# Altium project 800U R3N3.PrjPCB
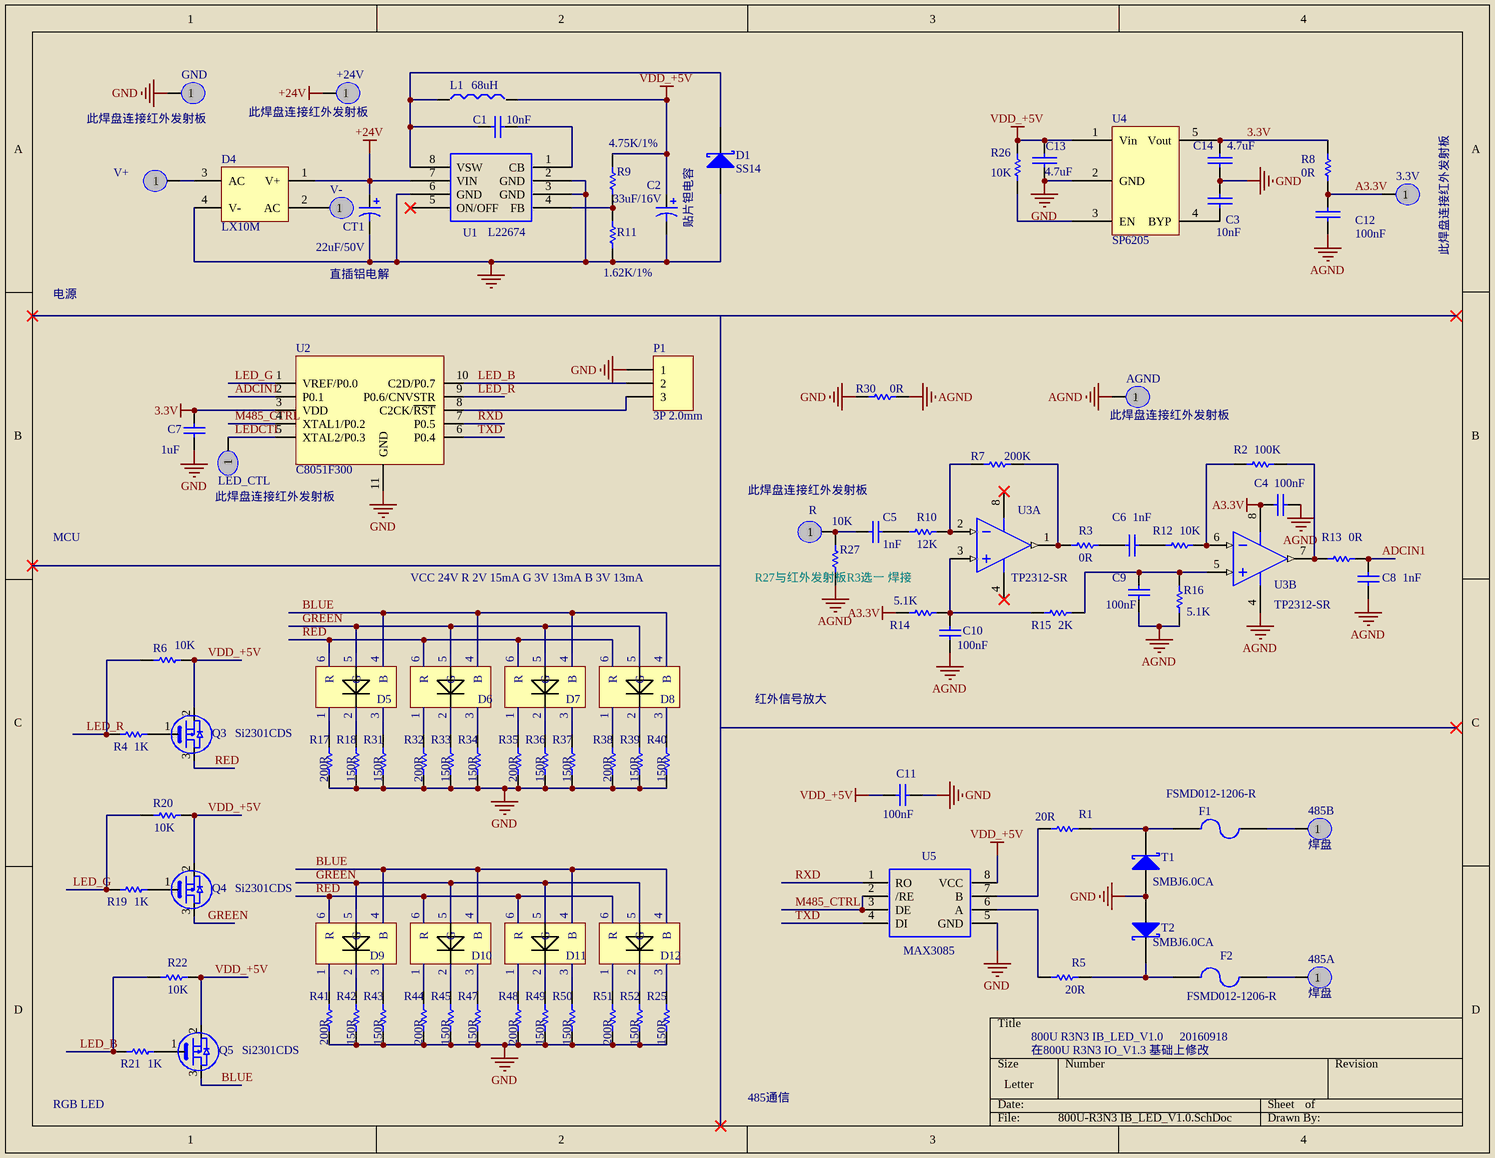
[diagram p0: 800U-R3N3 IB_LED_V1.0.SchDoc]
1 sheet, 96 parts. Net scope: global (net labels, ports and power ports of the same name join across sheets).
Board file: 800U R3N3 IB_LED_V1.0.PcbDoc

## Sheet 800U-R3N3 IB_LED_V1.0.SchDoc
size Letter

### Parts
3.3V  (no value)  [HOLE_SMD]
485A  焊盘  [HOLE_SMD]
485B  焊盘  [HOLE_SMD]
+24V  (no value)  [HOLE_SMD]
AGND  (no value)  [HOLE_SMD]
C1  10nF  [C0603]
C2  33uF/16V  Kind: 贴片钽电容  [CT3528]
C3  10nF  [C0603]
C4  100nF  [C0603]
C5  1nF  [C0603]
C6  1nF  [C0603]
C7  1uF  [C0603]
C8  1nF  [C0603]
C9  100nF  [C0603]
C10  100nF  [C0603]
C11  100nF  [C0603]
C12  100nF  [C0603]
C13  4.7uF  [C0603]
C14  4.7uF  [C0603]
CT1  22uF/50V  Kind: 直插铝电解  [RB0.1]
D1  SS14  [SMB]
D4  LX10M  [桥堆 3.8*3.5]
D5  5050RGB  [5050RGB]  (value not drawn)
D6  5050RGB  [5050RGB]  (value not drawn)
D7  5050RGB  [5050RGB]  (value not drawn)
D8  5050RGB  [5050RGB]  (value not drawn)
D9  5050RGB  [5050RGB]  (value not drawn)
D10  5050RGB  [5050RGB]  (value not drawn)
D11  5050RGB  [5050RGB]  (value not drawn)
D12  5050RGB  [5050RGB]  (value not drawn)
F1  FSMD012-1206-R  [1206]
F2  FSMD012-1206-R  [1206]
GND  (no value)  [HOLE_SMD]
L1  68uH  [L-6X6]
LED_CTL  (no value)  [HOLE_SMD]
P1  3P 2.0mm  [SIP3]
Q3  Si2301CDS  [SOT-23]
Q4  Si2301CDS  [SOT-23]
Q5  Si2301CDS  [SOT-23]
R  (no value)  [HOLE_SMD]
R1  20R  [2010]
R2  100K  [R0603]
R3  0R  [R0603]
R4  1K  [R0603]
R5  20R  [2010]
R6  10K  [R0603]
R7  200K  [R0603]
R8  0R  [R0603]
R9  4.75K/1%  [R0603]
R10  12K  [R0603]
R11  1.62K/1%  [R0603]
R12  10K  [R0603]
R13  0R  [R0603]
R14  5.1K  [R0603]
R15  2K  [R0603]
R16  5.1K  [R0603]
R17  200R  [0805]
R18  150R  [0805]
R19  1K  [R0603]
R20  10K  [R0603]
R21  1K  [R0603]
R22  10K  [R0603]
R25  150R  [0805]
R26  10K  [R0603]
R27  10K  [R0603]
R30  0R  [R0603]
R31  150R  [0805]
R32  200R  [0805]
R33  150R  [0805]
R34  150R  [0805]
R35  200R  [0805]
R36  150R  [0805]
R37  150R  [0805]
R38  200R  [0805]
R39  150R  [0805]
R40  150R  [0805]
R41  200R  [0805]
R42  150R  [0805]
R43  150R  [0805]
R44  200R  [0805]
R45  150R  [0805]
R47  150R  [0805]
R48  200R  [0805]
R49  150R  [0805]
R50  150R  [0805]
R51  200R  [0805]
R52  150R  [0805]
T1  (no value)  [HSMA]
T2  (no value)  [HSMA]
U1  L22674  [SO-1.27-9/4.0]
U2  C8051F300  [QFN-11]
U3  TP2312-SR  [SO-8]  (parts A,B of 2)
U4  SP6205  [SOT-23-5]
U5  MAX3085  [SO-1.27-8/4.0]
V+  (no value)  [HOLE_SMD]
V-  (no value)  [HOLE_SMD]

### Nets
3.3V: C7.1 C14.1 R8.1 U2.3(VDD) U4.5(Vout)
+24V: +24V.1 CT1.1 D4.1(V+) U1.7(VIN)
A3.3V: 3.3V.1 C4.1 C12.2 R8.2 R14.1 U3.8(VCC)
AGND: AGND.1 C4.2 C8.1 C9.2 C10.2 C12.1 R16.1 R27.2 R30.2 U3.4(VEE)
GND: C2.2 C3.2 C7.2 C11.1 C13.2 C14.2 CT1.2 D1.1(A) D4.4(V-) GND.1 P1.1 R11.1 R17.1 R18.1 R25.1 R30.1 R31.1 R32.1 R33.1 R34.1 R35.1 R36.1 R37.1 R38.1 R39.1 R40.1 R41.1 R42.1 R43.1 R44.1 R45.1 R47.1 R48.1 R49.1 R50.1 R51.1 R52.1 T1.1(A) T2.1(A) U1.2(GND) U1.3(GND) U1.6(GND) U2.11(GND) U4.2(GND) U5.5(GND)
VDD_+5V: C2.1 C11.2 C13.1 L1.2 Q3.2(S) Q4.2(S) Q5.2(S) R6.1 R9.2 R20.1 R22.1 R26.1 U4.1(Vin) U5.8(VCC)
ADCIN1: C8.2 R13.2 U2.2(P0.1)
BLUE: D5.4(B) D6.4(B) D7.4(B) D8.4(B) D9.4(B) D10.4(B) D11.4(B) D12.4(B) Q5.3(D)
GREEN: D5.5(G) D6.5(G) D7.5(G) D8.5(G) D9.5(G) D10.5(G) D11.5(G) D12.5(G) Q4.3(D)
LED_B: P1.2 R21.2 R22.2 U2.10(C2D/P0.7)
LED_G: R19.2 R20.2 U2.1(VREF/P0.0)
LED_R: R4.2 R6.2 U2.9(P0.6/CNVSTR)
LEDCTL: LED_CTL.1 U2.5(XTAL2/P0.3)
M485_CTRL: U2.4(XTAL1/P0.2) U5.2(/RE) U5.3(DE)
RED: D5.6(R) D6.6(R) D7.6(R) D8.6(R) D9.6(R) D10.6(R) D11.6(R) D12.6(R) Q3.3(D)
RXD: U2.7(P0.5) U5.1(RO)
TXD: U2.6(P0.4) U5.4(DI)
Net485A_1: 485A.1 F2.2
Net485B_1: 485B.1 F1.2
NetC1_1: C1.1 U1.1(CB)
NetC1_2: C1.2 D1.2(K) L1.1 U1.8(VSW)
NetC3_1: C3.1 U4.4(BYP)
NetC5_1: C5.1 R.1 R27.1
NetC5_2: C5.2 R10.1
NetC6_1: C6.1 R3.2
NetC6_2: C6.2 R12.1
NetC9_1: C9.1 R15.2 R16.2 U3.5(IN+)
NetC10_1: C10.1 R14.2 R15.1 U3.3(IN+)
NetD4_2: D4.2(AC) V-.1
NetD4_3: D4.3(AC) V+.1
NetD5_1: D5.1 R17.2
NetD5_2: D5.2 R18.2
NetD5_3: D5.3 R31.2
NetD6_1: D6.1 R32.2
NetD6_2: D6.2 R33.2
NetD6_3: D6.3 R34.2
NetD7_1: D7.1 R35.2
NetD7_2: D7.2 R36.2
NetD7_3: D7.3 R37.2
NetD8_1: D8.1 R38.2
NetD8_2: D8.2 R39.2
NetD8_3: D8.3 R40.2
NetD9_1: D9.1 R41.2
NetD9_2: D9.2 R42.2
NetD9_3: D9.3 R43.2
NetD10_1: D10.1 R44.2
NetD10_2: D10.2 R45.2
NetD10_3: D10.3 R47.2
NetD11_1: D11.1 R48.2
NetD11_2: D11.2 R49.2
NetD11_3: D11.3 R50.2
NetD12_1: D12.1 R51.2
NetD12_2: D12.2 R52.2
NetD12_3: D12.3 R25.2
NetF1_1: F1.1 R1.1 T1.2(K)
NetF2_1: F2.1 R5.1 T2.2(K)
NetP1_3: P1.3 U2.8(C2CK/~{RST})
NetQ3_1: Q3.1(G) R4.1
NetQ4_1: Q4.1(G) R19.1
NetQ5_1: Q5.1(G) R21.1
NetR1_2: R1.2 U5.7(B)
NetR2_1: R2.1 R12.2 U3.6(IN-)
NetR2_2: R2.2 R13.1 U3.7(OUT)
NetR3_1: R3.1 R7.2 U3.1(OUT)
NetR5_2: R5.2 U5.6(A)
NetR7_1: R7.1 R10.2 U3.2(IN-)
NetR9_1: R9.1 R11.2 U1.4(FB)
NetR26_2: R26.2 U4.3(EN)

Not connected (* = marked no-connect by the designer): U1 5(ON/OFF)*

### Notes on the sheet
- 电源
- MCU
- VCC 24V R 2V 15mA G 3V 13mA B 3V 13mA
- 红外信号放大
- 800U R3N3 IB_LED_V1.0
- 20160918
- RGB LED
- 485通信
- 在800U R3N3 IO_V1.3 基础上修改
- (in symbol Res Semi) R27与红外发射板R3选一 焊接
- (in symbol 焊盘) 此焊盘连接红外发射板

### Library data of the parts
3.3V +24V AGND GND LED_CTL R V+ V- = 焊盘
C1 C4-C6 C8-C10 = Cap: Capacitor; Kind: 贴片电容; Published: 8-Jun-2000; LatestRevisionDate: 17-Jul-2002; LatestRevisionNote: Re-released for DXP Platform.; PackageReference: RAD-0.3; Publisher: Altium Limited
  C1: PackageDescription: Radial Cap, Thru-Hole; 2 Leads; 0.3 in Pin Spacing
C2 CT1 = Cap Pol1: Polarized Capacitor (Radial); Published: 8-Jun-2000; LatestRevisionDate: 17-Jul-2002; LatestRevisionNote: Re-released for DXP Platform.; PackageReference: RB7.6-15
C3 C12-C14 = CAP: Capacitor; Kind: 贴片电容
C7 = Cap: 贴片电容; Published: 8-Jun-2000; LatestRevisionDate: 17-Jul-2002; LatestRevisionNote: Re-released for DXP Platform.; PackageReference: RAD-0.3; Publisher: Altium Limited; Kind: 贴片电容
C11 = Cap: 贴片陶瓷电容; Kind: 陶瓷电容
D1 = SMBJ6.0CA: Kind: 贴片二极管
D4 = Bridge2: 贴片桥堆; Kind: 贴片桥堆
D5-D12 = 5050RGB: RBG发光管; Kind: 贴片LED
F1 F2 = Fuse 2: 可恢复保险丝; Kind: 可恢复保险丝
L1 = 电感: Kind: 贴片电感
P1 = MHDR1X3: 插座; Kind: 下载接口; LatestRevisionDate: 17-Jul-2002; LatestRevisionNote: Re-released for DXP Platform.; Publisher: Altium Limited
Q3-Q5 = P-MOSFET: 贴片MOS管; Kind: MOS管
R1 R5 = Res Semi: 贴片电阻; Kind: 电阻
R2 R3 R7 R9-R16 R27 R30 = Res Semi: Semiconductor Resistor; Kind: 贴片电阻
  R9 R11: Published: 8-Jun-2000; LatestRevisionDate: 17-Jul-2002; LatestRevisionNote: Re-released for DXP Platform.; PackageReference: AXIAL-0.5; Publisher: Altium Limited
R4 R6 R17-R22 R25 R31-R45 R47-R52 = Res Semi: 贴片电阻; Kind: 贴片电阻
R8 R26 = Res1: Resistor; Kind: 贴片电阻; Published: 8-Jun-2000; LatestRevisionDate: 17-Jul-2002; LatestRevisionNote: Re-released for DXP Platform.; PackageReference: AXIAL-0.3; Publisher: Altium Limited
T1 T2 = SMBJ6.0CA: TVS管; 型号: SMBJ6.0CA
U1 = 2674: Kind: 贴片芯片; PCB DECAL: SO-1.27-9/4.0
U2 = PIC16C505: 贴片芯片; Kind: 贴片芯片
U3 = LM833D: Dual Low Noise, Audio Amplifier; Kind: 贴片芯片
U4 = SP6203/SP6205: Kind: 贴片芯片
U5 = MAX_485: 贴片芯片; Kind: 芯片